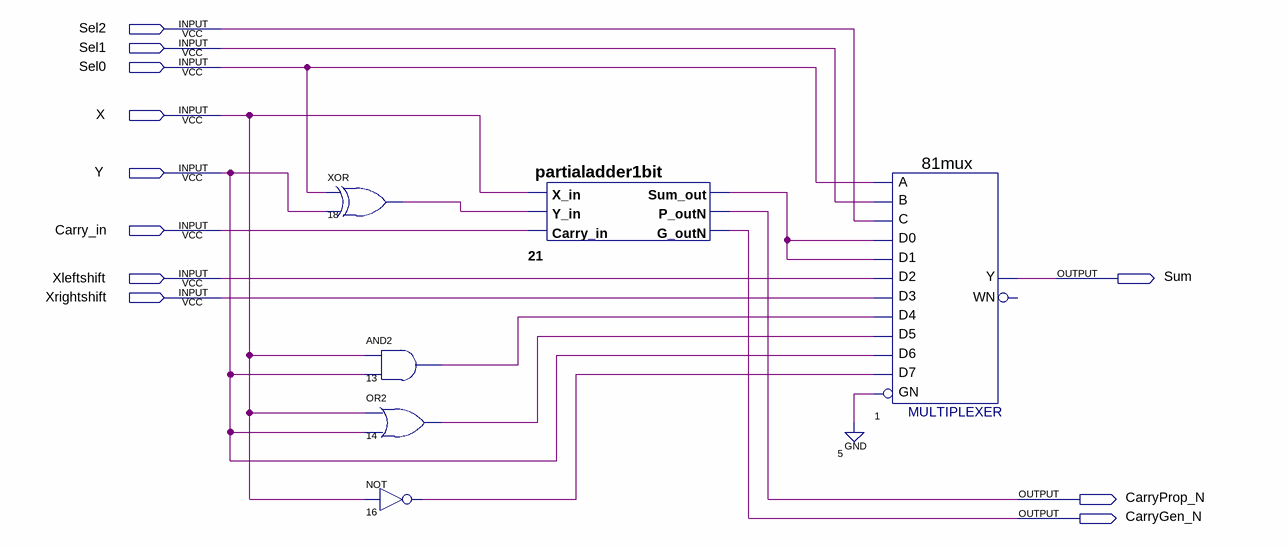
[diagram p0: schematic sheet]
// Quartus schematic alu1bit.bdf as structural Verilog: 6 symbols, 11 pins
module alu1bit (
  input  Sel2,
  input  Sel1,
  input  Sel0,
  input  X,
  input  Y,
  input  Carry_in,
  input  Xleftshift,
  input  Xrightshift,
  output Sum,
  output CarryProp_N,
  output CarryGen_N
);

  wire n13_out, n14_out, n16_out, n18_out, n21_sum_out;

  xor u_18 (n18_out, Sel0, Y);
  and u_13 (n13_out, X, Y);
  or u_14 (n14_out, X, Y);
  not u_16 (n16_out, X);
  partialadder1bit u_21 (
    .X_in(X), .Y_in(n18_out), .Carry_in(Carry_in), .Sum_out(n21_sum_out), .P_outN(CarryProp_N),
    .G_outN(CarryGen_N));
  \81mux  u_1 (
    .B(Sel1), .C(Sel2), .D1(n21_sum_out), .D0(n21_sum_out), .D5(n14_out), .D4(n13_out), .D3(Xrightshift),
    .D2(Xleftshift), .GN(1'b0), .D7(n16_out), .D6(Y), .A(Sel0), .Y(Sum));  // open: WN
endmodule
